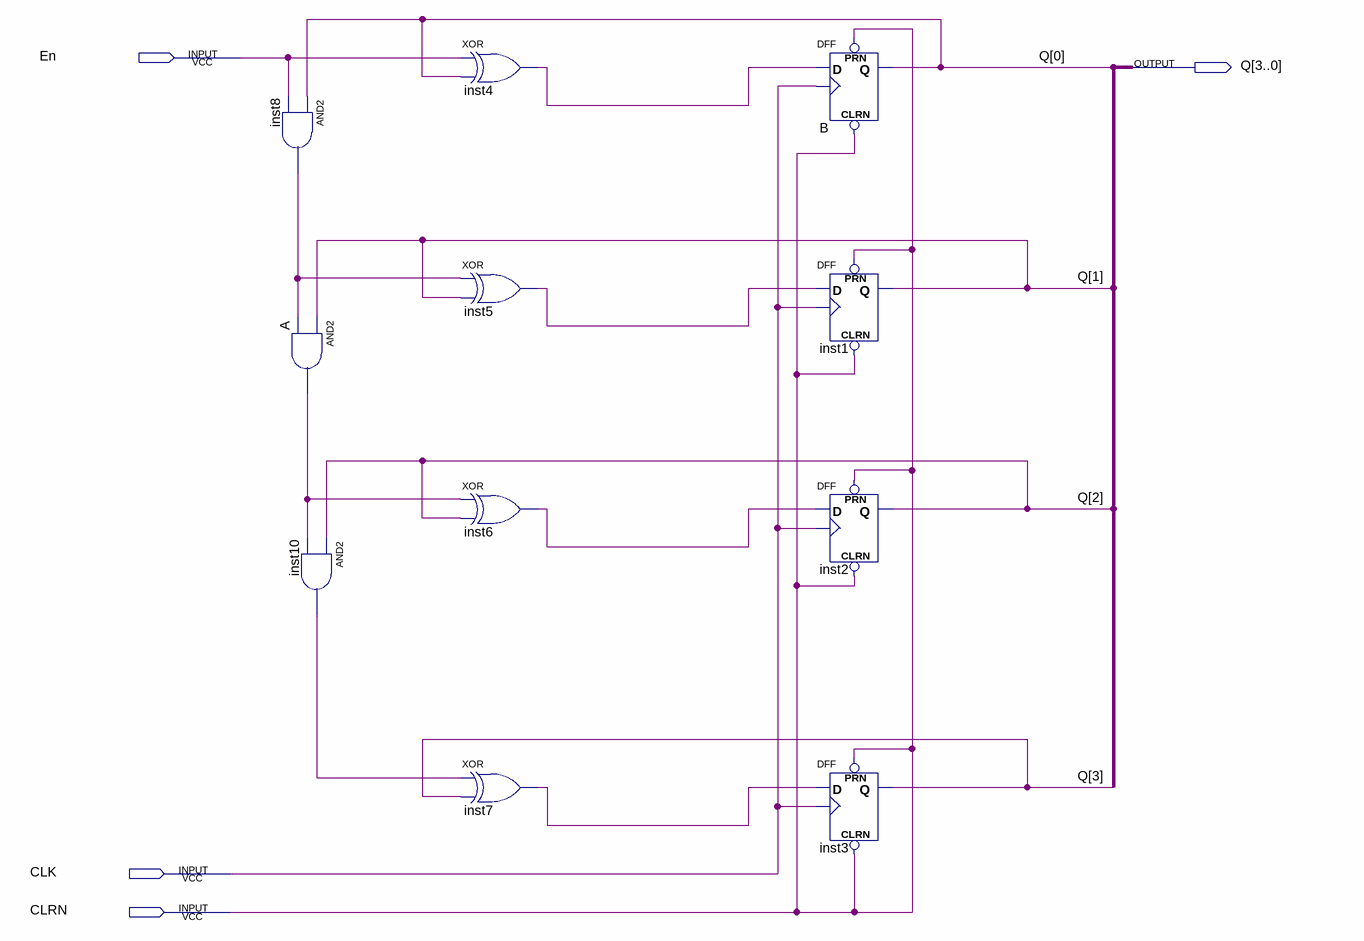
[diagram p0: schematic sheet]
// Quartus schematic four_bit_counter.bdf as structural Verilog: 11 symbols, 4 pins
module four_bit_counter (
  input  En,
  input  CLK,
  input  CLRN,
  output [3:0] Q
);

  wire A_out, inst4_out, inst5_out, inst6_out, inst7_out, inst8_out, inst10_out;

  and inst8 (inst8_out, Q[0], En);
  and A (A_out, Q[1], inst8_out);
  and inst10 (inst10_out, Q[2], A_out);
  xor inst4 (inst4_out, En, Q[0]);
  xor inst5 (inst5_out, inst8_out, Q[1]);
  xor inst6 (inst6_out, A_out, Q[2]);
  xor inst7 (inst7_out, inst10_out, Q[3]);
  DFF B (.CLRN(CLRN), .CLK(CLK), .D(inst4_out), .PRN(CLRN), .Q(Q[0]));
  DFF inst1 (.CLRN(CLRN), .CLK(CLK), .D(inst5_out), .PRN(CLRN), .Q(Q[1]));
  DFF inst2 (.CLRN(CLRN), .CLK(CLK), .D(inst6_out), .PRN(CLRN), .Q(Q[2]));
  DFF inst3 (.CLRN(CLRN), .CLK(CLK), .D(inst7_out), .PRN(CLRN), .Q(Q[3]));
endmodule
